# EAGLE design owss (EAGLE 6.6.0)
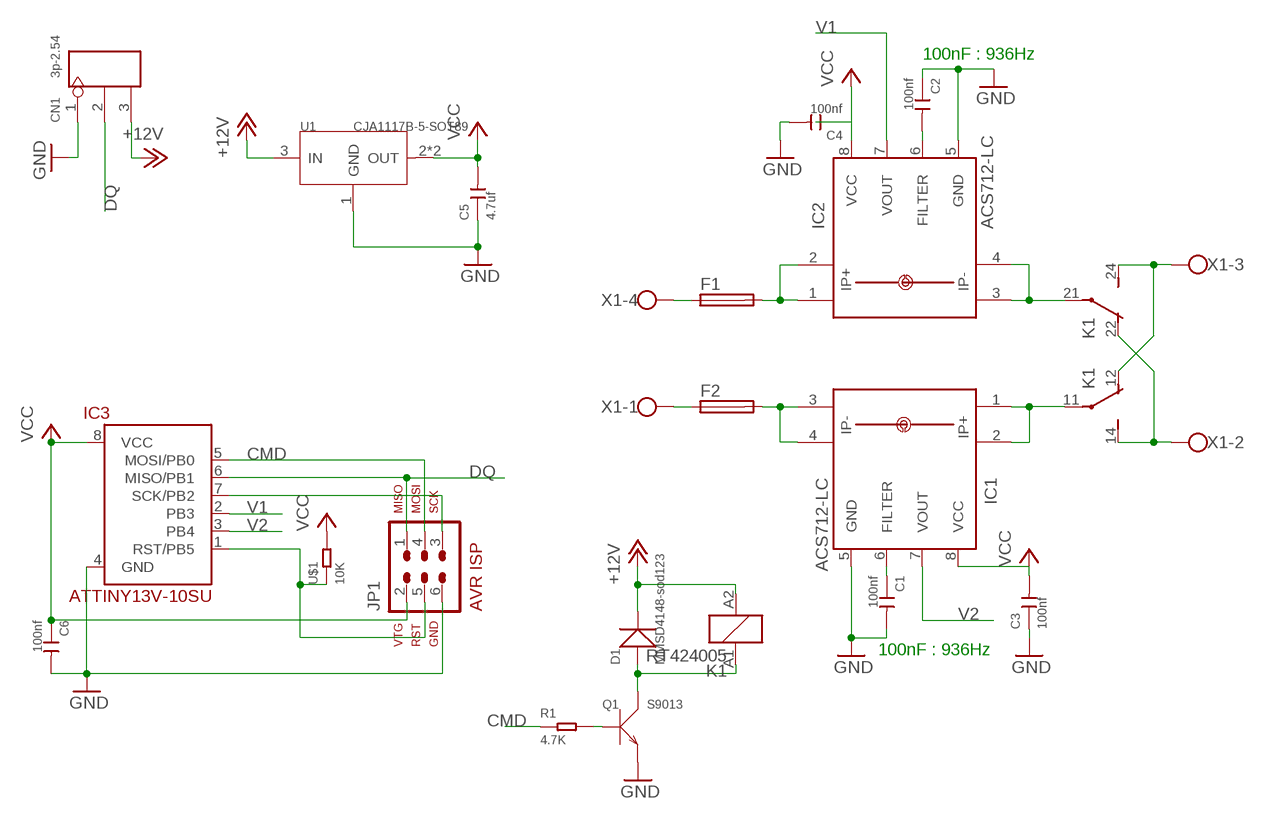
[diagram p0: schematic, sheet 1]

## Parts
C1  100nf  CERAMIC-100NF-50V-10%-X7R(0805)  [C0805]
C2  100nf  CERAMIC-100NF-50V-10%-X7R(0805)  [C0805]
C3  100nf  CERAMIC-100NF-50V-10%-X7R(0805)  [C0805]
C4  100nf  CERAMIC-100NF-50V-10%-X7R(0805)  [C0805]
C5  4.7uf  CERAMIC-4.7UF-25V-10%-X5R(0805)  [C0805]
C6  100nf  CERAMIC-100NF-50V-10%-X7R(0805)  [C0805]
CN1  3p-2.54  DIP-BLACK-MALE-HEADER-VERT(3P-2.54)  [H3-2.54]
D1  MMSD4148-sod123  SMD-DIODE-100V-200MA(SOD-123)  [SOD-123]
F1  TE5  [TE5]
F2  TE5  [TE5]
IC1  ACS712-LC  [SOIC8]
IC2  ACS712-LC  [SOIC8]
IC3  ATTINY13V-10SU  [SOIC8]
JP1  AVR-ISP-6  [AVR-ISP-6]
K1  RT424005  [RT2C/O]
Q1  S9013  SMD-TRANSISTORS-NPN-25V-500MA-S9013(SOT-23)  [SOT-23]
R1  4.7K  SMD-RES-4.7K-5%-1/8W(0805)  [R0805]
U1  CJA1117B-5-SOT89  PMIC-CJA1117B-3.3(SOT-89)  [SOT-89]
U$1  10K  SMD-RES-10K-1%-1/8W(0805)  [R0805]
X1  W237-4  [W237-4]

## Nets
+12V: CN1.3 D1.- K1.A2 U1.3(IN)
CMD: IC3.5(MOSI/PB0) JP1.4 R1.1
DQ: CN1.2 IC3.6(MISO/PB1) JP1.1
GND: C1.2 C2.1 C3.1 C4.2 C5.1 C6.2 CN1.1 IC1.5(GND) IC2.5(GND) IC3.4(GND) JP1.6 Q1.2(E) U1.1(GND)
N$1: IC1.1(IP+) IC1.2(IP+1) K1.11(2:P)
N$2: F1.2 IC2.1(IP+) IC2.2(IP+1)
N$3: F1.1 X1.4
N$4: F2.2 IC1.3(IP-) IC1.4(IP-1)
N$5: K1.12(2:O) K1.24(3:S) X1.3
N$6: F2.1 X1.1
N$7: IC2.3(IP-) IC2.4(IP-1) K1.21(3:P)
N$8: C1.1 IC1.6(FILTER)
N$9: D1.+ K1.A1 Q1.3(C)
N$10: C2.2 IC2.6(FILTER)
N$11: K1.14(2:S) K1.22(3:O) X1.2
N$12: Q1.1(B) R1.2
N$14: IC3.7(SCK/PB2) JP1.3
N$15: IC3.1(RST/PB5) JP1.5 U$1.1
V1: IC2.7(VOUT) IC3.2(PB3)
V2: IC1.7(VOUT) IC3.3(PB4)
VCC: C3.2 C4.1 C5.2 C6.1 IC1.8(VCC) IC2.8(VCC) IC3.8(VCC) JP1.2 U1.2(OUT) U1.4(OUT) U$1.2

## Notes on the sheet
- 100nF : 936Hz
- 100nF : 936Hz

## Library data of the parts
C1-C4 C6 = Seeed-Capacitor-2016:CERAMIC-100NF-50V-10%-X7R(0805): 302010165; MPN: CC0805KRX7R9BB104
C5 = Seeed-Capacitor-2016:CERAMIC-4.7UF-25V-10%-X5R(0805): 302010146; MPN: CC0805KKX5R8BB475
CN1 = Seeed-Connector -2016:DIP-BLACK-MALE-HEADER-VERT(3P-2.54): 320020079
D1 = Seeed-Diode-2016:SMD-DIODE-100V-200MA(SOD-123): 304010007; MPN: MMSD4148
F1 F2 = fuse:TE5: FUSE Wickmann; OC_FARNELL: unknown; OC_NEWARK: unknown
IC1 IC2 = allegro-2:ACS712-LC
IC3 = attiny13:ATTINY13V-10*
JP1 = atmel-1:AVR-ISP-6: AVR ISP-6 Serial Programming Header
K1 = relay:RT42?*: Power PCB Relay SCHRACK 2 pole 8 A, DC and AC-coil Source: http://www.schrack.com/.. 5842.pdf; MPN: RT424005; OC_FARNELL: 1629052; OC_NEWARK: 03P2425
Q1 = Seeed-Transistor-2016:SMD-TRANSISTORS-NPN-25V-500MA-S9013(SOT-23): 305010018; MPN: S9013
R1 = Seeed-Resistor-2016:SMD-RES-4.7K-5%-1/8W(0805): 301010306; MPN: RC0805JR-074K7L
U1 = Seeed-IC-2016:PMIC-CJA1117B-3.3(SOT-89): 310030095; MPN: CJA1117B-3.3; VALUE: CJA1117B-3.3-SOT89
U$1 = Seeed-Resistor-2016:SMD-RES-10K-1%-1/8W(0805): 301010361; MPN: RC0805FR-0710KL
X1 = con-wago-500:W237-4: WAGO SCREW CLAMP; OC_FARNELL: unknown; OC_NEWARK: unknown

## Board
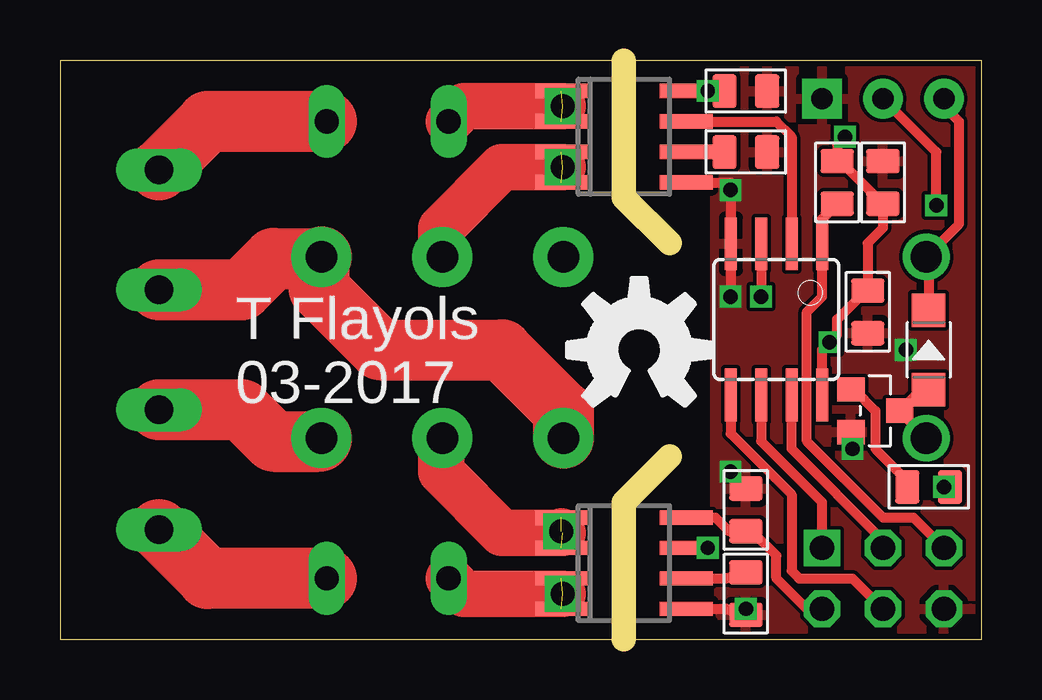
[diagram p1: board, top side]
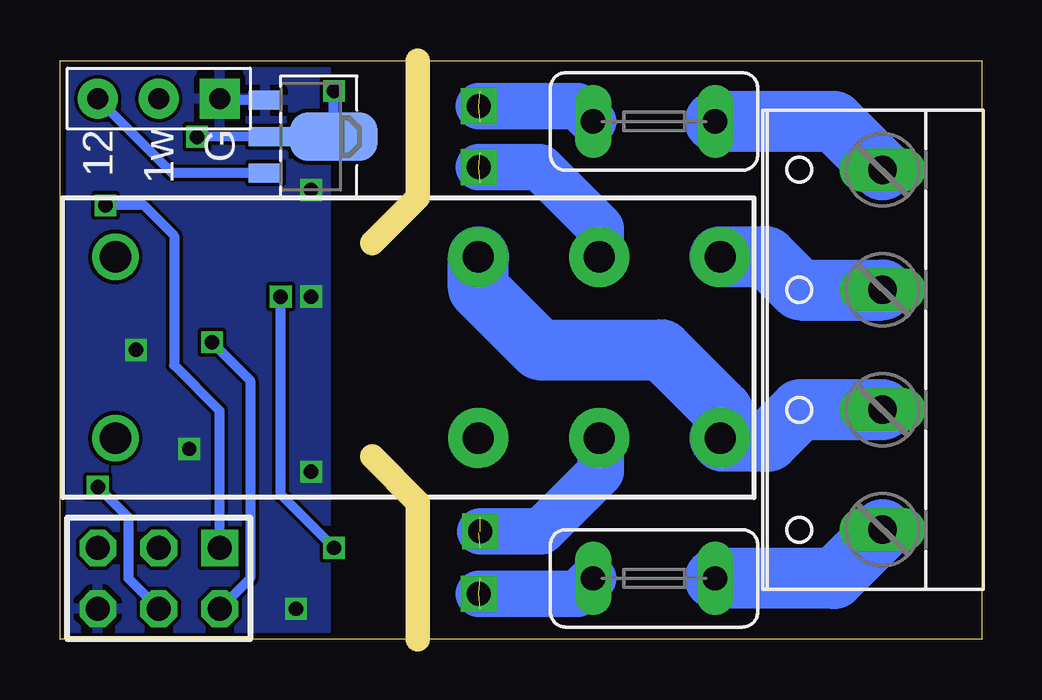
[diagram p2: board, bottom side, seen from below]

Size 38.41 x 24.12 mm. Coordinates in mm from the lower left corner, seen from the top.
Outline: 0,0 38.41,0 38.41,24.12 0,24.12 0,0
Copper layers (1*16): Top 0.035mm / dielectric 1.5mm / Bottom 0.035mm
Design rules "SeeedStudio_2layer_DRU_no_angle_20140221": minimum track width 6mil, minimum drill 12mil, track to track 6mil, track to pad 6mil, pad to pad 6mil, via to via 6mil, smd to smd 0mil, copper to edge 10mil, drill to drill 10mil, minimum pad ring 10mil, minimum via ring 6mil, stop-mask expansion 2mil, vias tented up to drill 100mil, thermal gap 10mil
Milling: 4 lines

### Footprints (pad centres in the part's own frame; a part is rotated, then mirrored left to right if it is on the bottom)
C0805 = smd 1.397 x 1.016: 1 0,0.889; 2 0,-0.889
H3-2.54 = drill 0.889 pad 1.651 square: 1 0,2.54 | drill 0.889 pad 1.651: 2 0,0; 3 0,-2.54
SOD-123 = smd 1.397 x 1.397: + -1.651,0; - 1.651,0
TE5 = drill 1.016 long: 1 -2.54,0; 2 2.54,0
SOIC8 = smd 0.6 x 2.2: 1 -1.905,-2.6; 2 -0.635,-2.6; 3 0.635,-2.6; 4 1.905,-2.6; 5 1.905,2.6; 6 0.635,2.6; 7 -0.635,2.6; 8 -1.905,2.6
SOIC8' = smd 0.5 x 2.2: 1 -1.905,-3.154; 2 -0.645,-3.154; 3 0.625,-3.154; 4 1.895,-3.154; 5 1.905,3.154; 6 0.635,3.154; 7 -0.635,3.154; 8 -1.905,3.154
AVR-ISP-6 = drill 1.016 square: 1 -2.54,-1.27 | drill 1.016 octagon: 2 -2.54,1.27; 3 0,-1.27; 4 0,1.27; 5 2.54,-1.27; 6 2.54,1.27
RT2C/O = drill 1.3 pad 2.5: 11 7.56,-3.68; 12 2.52,-3.68; 14 12.6,-3.68; 21 7.56,3.88; 22 2.52,3.88; 24 12.6,3.88 | drill 1.3: A1 -12.6,-3.68; A2 -12.6,3.88
SOT-23 = smd 1.016 x 1.143: 1 -0.889,-1.016; 2 0.889,-1.016; 3 0,1.016
R0805 = smd 1.397 x 1.016: 1 0,0.889; 2 0,-0.889
SOT-89 = smd 0.8 x 1.4: 1 -1.524,-1.905; 3 1.524,-1.905 | smd 0.8 x 1.9: 2 0,-1.651 | smd 2.032 x 3.65: 4 0,0.94
W237-4 = drill 1.194 long: 1 -7.5,-1.27; 2 -2.5,-1.27; 3 2.5,-1.27; 4 7.5,-1.27

### Placement (x,y rotation side)
C1  28.57,1.91 0 top
C2  28.57,20.32 270 top
C3  28.57,5.4 0 top
C4  28.57,22.86 90 top
C5  34.29,19.05 0 top
C6  33.66,13.65 0 top
CN1  34.29,22.54 270 bottom
D1  36.2,12.06 90 top
F1  13.65,21.59 180 bottom
F2  13.65,2.54 180 bottom
IC1  23.5,3.17 270 top
IC2  23.5,20.95 270 top
IC3  ATTINY13V-10SU  [SOIC8']  29.84,13.34 180 top
JP1  34.29,2.54 180 bottom
K1  23.5,12.06 0 bottom
Q1  33.97,9.53 270 top
R1  36.2,6.35 270 top
U1  27.94,20.95 270 bottom
U$1  32.38,19.05 180 top
X1  5.4,12.06 90 bottom

### Tracks (layer width: path | path; a pad name or v marks a point on that pad's centre or on a via)
+12V
  Top 0.406: D1.- 36.2,15.9 36.54,16.19 36.34,16.19 | 36.34,16.19 K1.A2 | 36.34,16.19 37.47,17.32 37.47,21.59 36.83,22.23 CN1.3
  Bottom 0.406: U1.3 33.72,19.43 CN1.3
CMD  (via drill 0.6)
  Top 0.406: IC3.5 27.94,8.57 30.48,6.03 30.48,2.86 30.8,2.54 33.02,2.54 JP1.4 | R1.1 v36.83,6.35
  Bottom 0.406: JP1.4 35.56,2.54 35.56,5.08 v36.83,6.35
DQ  (via drill 0.6)
  Top 0.406: IC3.6 29.21,8.26 31.75,5.71 JP1.1 | CN1.2 36.51,20.32 v36.51,18.1
  Bottom 0.406: JP1.1 31.75,9.53 33.66,11.43 33.66,16.83 34.92,18.1 v36.51,18.1
GND  (via drill 0.6)
  Top 0.406: IC1.5 27.75,1.27 C1.2 | 26.05,19 IC2.5 27.94,19.05 v27.94,14.29 | Q1.2 33.02,8.57 v33.02,7.94
  Bottom 0.406: U1.1 31.69,22.48 CN1.1
  other vias: 28.57,1.27 27.94,6.99 35.24,12.06 27.94,18.73
  pour Top: 27.3,23.81 38.42,23.81 38.42,0.32 27.3,0.32
  pour Bottom: 27.3,23.81 38.42,23.81 38.42,0.32 27.3,0.32
N$1  (via drill 1)  (2 unrouted)
  Top 1.93: v20.89,4.5 20.95,4.45 18.41,4.45 15.88,6.99 15.88,8.26
  Bottom 1.93: v20.89,4.5 18.36,4.5 15.88,6.99 15.88,8.32 K1.11
N$2  (via drill 1)  (2 unrouted)
  Top 1.93: v20.95,22.23 16.83,22.23 F1.2
  Bottom 1.93: F1.2 16.83,22.23 v20.95,22.23
N$3
  Top 2.54: F1.1 6.15,21.59 X1.4
  Bottom 2.54: X1.4 6.15,21.59 F1.1
N$4  (via drill 1)  (2 unrouted)
  Top 1.93: F2.2 16.83,1.91 v20.95,1.91
  Bottom 1.93: v20.95,1.91 16.83,1.91 F2.2
N$5
  Top 2.54: X1.3 7.58,14.56 8.89,15.88 10.82,15.88 | K1.12 20.98,9.51 18.41,12.06 13.34,12.06 10.79,14.61 10.79,15.85 10.82,15.88 | 10.82,15.88 K1.24
  Bottom 2.54: X1.3 7.58,14.56 8.96,15.95 K1.24
N$6
  Top 2.54: F2.1 6.15,2.54 X1.1
  Bottom 2.54: X1.1 6.15,2.54 F2.1
N$7  (via drill 1)  (2 unrouted)
  Top 1.93: v20.95,19.68 18.41,19.68 15.88,17.14 15.88,15.88
  Bottom 1.778: 15.88,17.14 15.94,17.09 K1.21
  Bottom 1.93: v20.95,19.68 18.41,19.68 15.88,17.14 15.88,15.88
N$8
  Top 0.406: IC1.6 27.75,2.54 C1.1
N$9
  Top 0.406: D1.+ 35.88,10.41 Q1.3 34.99,9.49 K1.A1
N$10
  Top 0.406: C2.2 IC2.6
N$11
  Top 2.54: X1.2 7.58,9.56 8.89,8.26 10.77,8.26 arc90 K1.14
  Bottom 2.54: X1.2 7.58,9.56 8.89,8.26 10.79,8.26 | K1.14 arc-90 10.79,8.48 10.79,9.53 13.34,12.06 18.41,12.06 20.98,14.62 K1.22
N$12
  Top 0.406: Q1.1 33.08,10.41 33.97,9.53 33.97,7.94 35.31,6.6 R1.2
N$14
  Top 0.406: IC3.7 30.48,7.94 34.29,4.13 JP1.3
N$15
  Top 0.406: JP1.5 35.56,5.08 34.29,5.08 31.11,8.26 31.11,13.65 31.75,14.29 IC3.1 31.75,17.53 U$1.1
V1
  Top 0.406: IC3.2 30.48,20.95 29.84,21.59 IC2.7
V2  (via drill 0.6)
  Top 0.406: v26.99,3.81 IC1.7 | IC3.3 29.22,14.62 v29.21,14.29
  Bottom 0.406: v26.99,3.81 29.21,6.03 v29.21,14.29
VCC  (via drill 0.6)
  Top 0.406: JP1.2 31.11,1.27 29.84,2.54 29.84,3.49 28.83,4.51 C3.2 27.88,4.51 27.3,5.08 IC1.8 | IC3.8 31.75,12.06 v32.07,12.38 32.38,12.7 32.38,13.34 33.59,14.54 C6.1 33.66,16.51 34.29,17.14 C5.2 32.51,19.94 U$1.2 32.38,20.64 v32.7,20.95 | IC2.8 v26.99,22.86 C4.1
  Bottom 0.406: v32.07,12.38 30.48,10.79 30.48,2.54 JP1.2 | v26.99,22.86 27,22.85 U1.4 U1.2 v32.7,20.95

### Text on the board
tNames: T Flayols / 03-2017
bNames: G | 1w | 12